# EAGLE design zigduino-v6a (EAGLE 5.10)
BOM: INCLUDE; COLOR: RED; DNP: T; PARTNO: PPPC081LFBN; VOLT: 40V
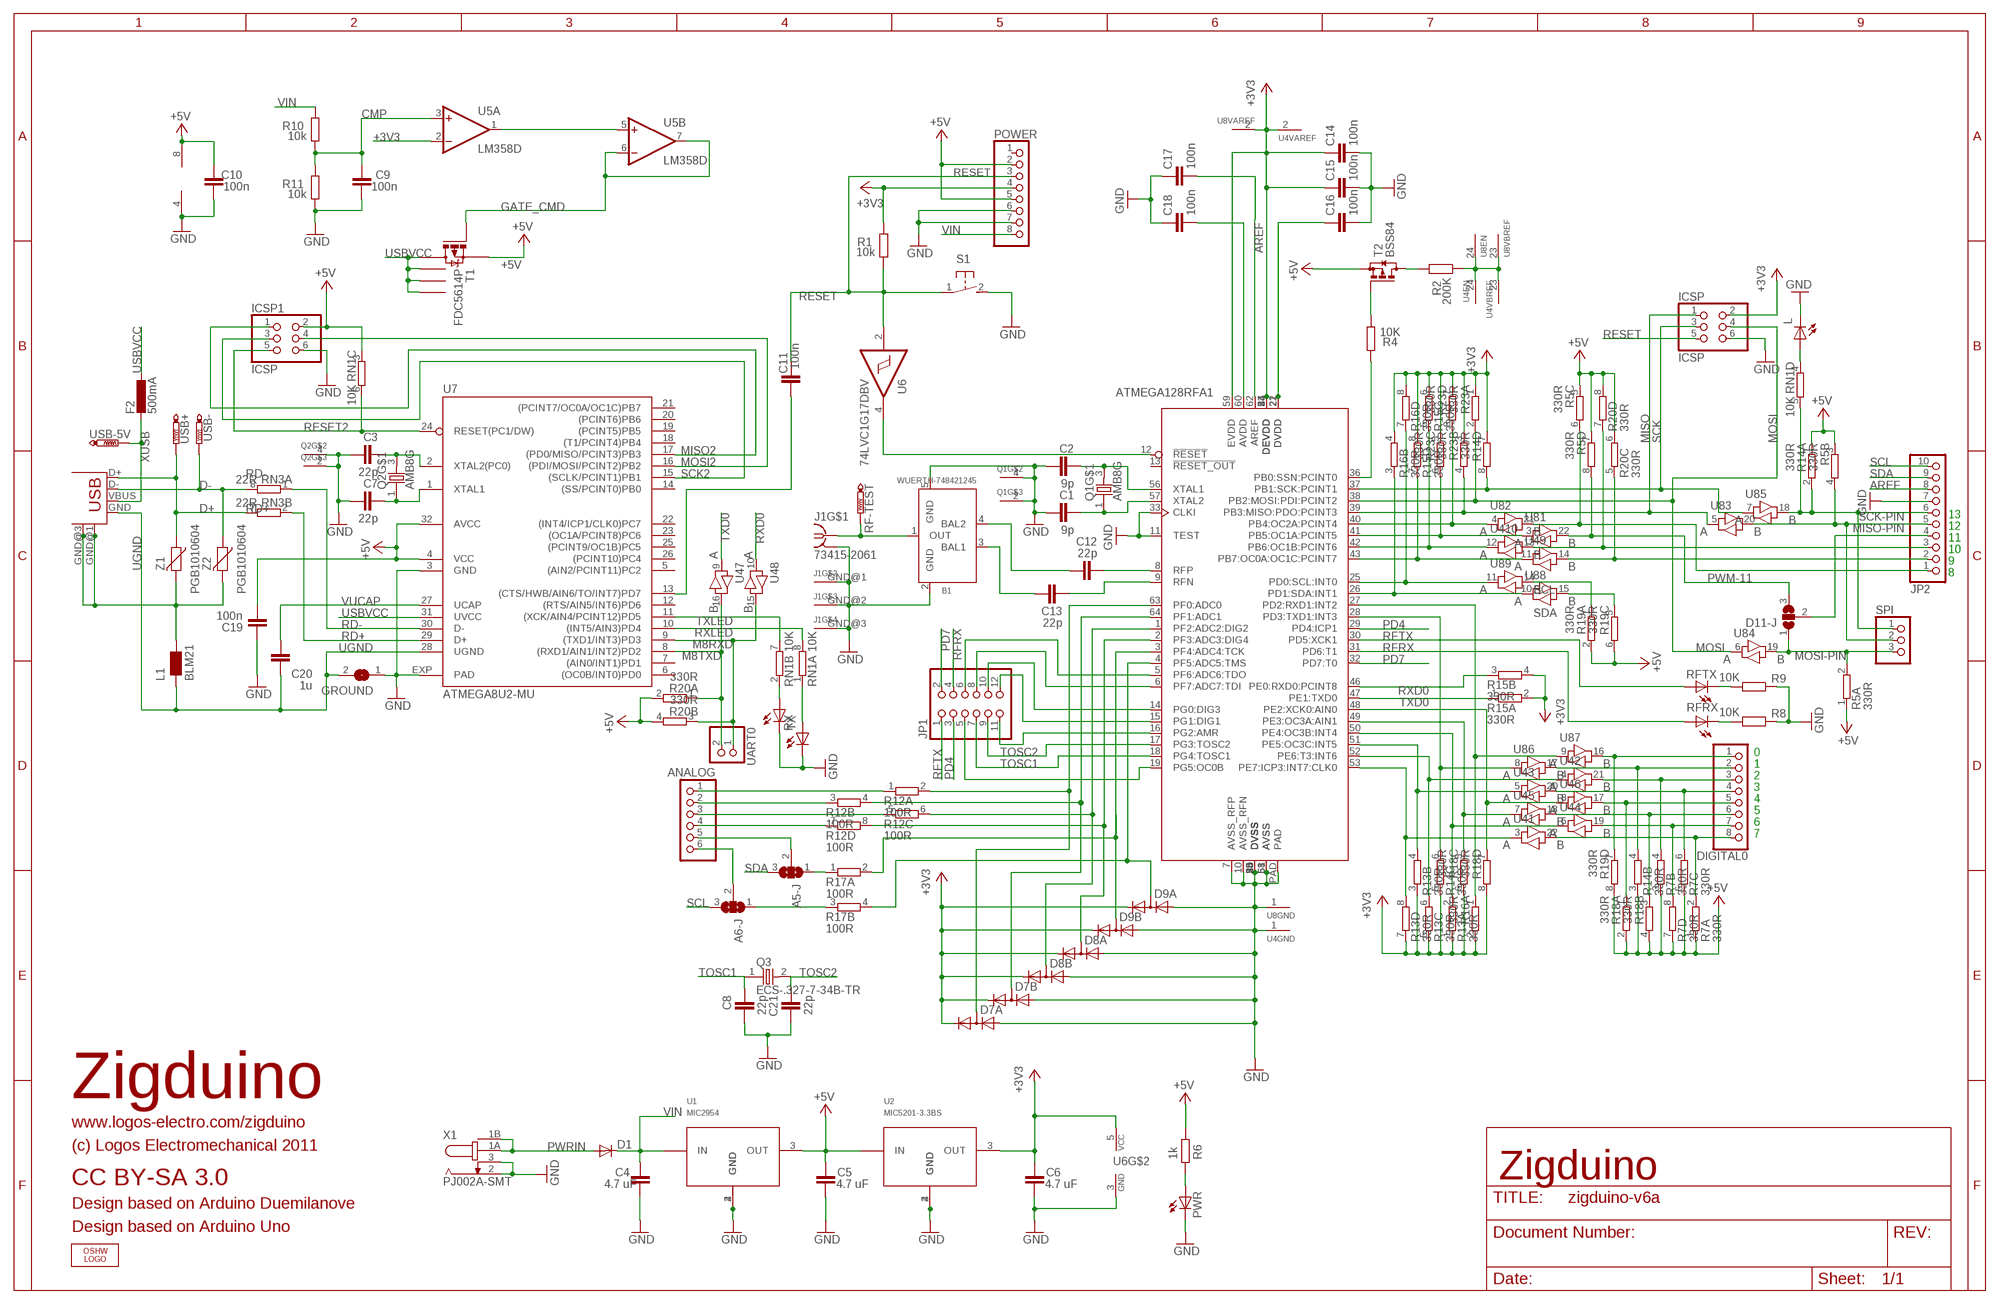
[diagram p0: schematic, sheet 1]

## Parts
A5-J  SJ2W  [SJ_2]
A6-J  SJ2W  [SJ_2]
ANALOG  PINHD-1X6  [1X06]
B1  WUERTH-748421245  [WURTH-BALUN]
C1  9p  C-EUC0603  [C0603]
C2  9p  C-EUC0603  [C0603]
C3  22p  C-EUC0603  [C0603]
C4  4.7 uF  C-EUC1206  [C1206]
C5  4.7 uF  C-EUC1206  [C1206]
C6  4.7 uF  C-EUC1206  [C1206]
C7  22p  C-EUC0603  [C0603]
C8  22p  C-EUC0603  [C0603]
C9  100n  C-EUC0603  [C0603]
C10  100n  C-EUC0603  [C0603]
C11  100n  C-EUC0603  [C0603]
C12  22p  C-EUC0603  [C0603]
C13  22p  C-EUC0603  [C0603]
C14  100n  C-EUC0603  [C0603]
C15  100n  C-EUC0603  [C0603]
C16  100n  C-EUC0603  [C0603]
C17  100n  C-EUC0603  [C0603]
C18  100n  C-EUC0603  [C0603]
C19  100n  C-EU0603-RND  [C0603-ROUND]
C20  1u  C-EU0603-RND  [C0603-ROUND]
C21  22p  C-EUC0603  [C0603]
D1  DIODE-SMB  [SMB]
D7  SD103ASDM  [SOT26]
D8  SD103ASDM  [SOT26]
D9  SD103ASDM  [SOT26]
D11-J  SJ2W  [SJ_2]
DIGITAL0  PINHD-1X8  [1X08]
F2  500mA  L-EUL1812  [L1812]
GROUND  SJ  [SJ]
ICSP  ICSP  PINHD-2X3  [2X03]
ICSP1  ICSP  PINHD-2X3  [2X03]
J1  73415-2061  [MMCX]
JP1  PINHD-2X6_2.00  [2X06M]
JP2  PINHD-1X10  [1X10]
L  LEDCHIP-LED0603  [CHIP-LED0603]
L1  BLM21  WE-CBF_0805  [0805]
LOGO1  OSHW_LOGO_FILLX0200-NT  [OSHW_FILLX200_NOTEXT]
POWER  PINHD-1X8  [1X08]
PWR  LEDCHIP-LED0603  [CHIP-LED0603]
Q1  AMB8G  [ABM8G]
Q2  AMB8G  [ABM8G]
Q3  ECS-.327-7-34B-TR  [ECX-31B]
R1  10k  R-EU_R0603  [R0603]
R2  200K  R-EU_R0603  [R0603]
R4  10K  R-EU_R0603  [R0603]
R5  330R  4R-NCTS742C083  [CTS742C083-RES]
R6  1k  R-EU_R0603  [R0603]
R7  330R  4R-NCTS742C083  [CTS742C083-RES]
R8  10K  R-EU_R0603  [R0603]
R9  10K  R-EU_R0603  [R0603]
R10  10k  R-EU_R0603  [R0603]
R11  10k  R-EU_R0603  [R0603]
R12  100R  4R-NCTS742C083  [CTS742C083-RES]
R13  330R  4R-NCTS742C083  [CTS742C083-RES]
R14  330R  4R-NCTS742C083  [CTS742C083-RES]
R15  330R  4R-NCTS742C083  [CTS742C083-RES]
R16  330R  4R-NCTS742C083  [CTS742C083-RES]
R17  100R  4R-NCTS742C083  [CTS742C083-RES]
R18  330R  4R-NCTS742C083  [CTS742C083-RES]
R19  330R  4R-NCTS742C083  [CTS742C083-RES]
R20  330R  4R-NCTS742C083  [CTS742C083-RES]
R23  330R  4R-NCTS742C083  [CTS742C083-RES]
RF-TEST  PTR1TP13SQ  [TP13SQ]
RFRX  LEDCHIP-LED0603  [CHIP-LED0603]
RFTX  LEDCHIP-LED0603  [CHIP-LED0603]
RN1  10K  4R-NCAY16  [CAY16]
RN3  22R  4R-NCAY16  [CAY16]
RX  LEDCHIP-LED0603  [CHIP-LED0603]
S1  B3U-1000  [B3U]
SPI  PINHD-1X3  [1X03]
T1  FDC5614P  [SSOT6]
T2  BSS84  [SOT23]
TX  LEDCHIP-LED0603  [CHIP-LED0603]
U1  MIC2954  [SOT223]
U2  MIC5201-3.3BS  [SOT223]
U3  ATMEGA128RFA1  [QFN64]
U4  NVT2010PW  [TSSOP24]
U5  LM358D  [SO08]
U6  74LVC1G17DBV  [SOT23-5]
U7  ATMEGA8U2-MU  [QFN32]
U8  NVT2010PW  [TSSOP24]
UART0  PINHD-1X2  [1X02]
USB  USB-MB-S  [USB-MB-S]
USB+  PTR1TP13SQ  [TP13SQ]
USB-  PTR1TP13SQ  [TP13SQ]
USB-5V  PTR1TP13SQ  [TP13SQ]
X1  PJ002A-SMT  [PJ002A-SMT]
Z1  PGB1010604  VARISTORCN0603  [CT/CN0603]
Z2  PGB1010604  VARISTORCN0603  [CT/CN0603]

## Nets
+3V3: C6.1 C14.1 C15.1 D7.2(A:C) D7.5(B:C) D8.2(A:C) D8.5(B:C) D9.2(A:C) D9.5(B:C) ICSP.2 POWER.4 R1.2 R13.1 R13.3 R13.5 R13.7 R14.5 R14.7 R15.2 R15.4 R15.6 R15.8 R16.2 R16.4 R16.8 R18.6 R18.8 R23.1 R23.3 R23.5 R23.7 U2.3(OUT) U3.23(DEVDD) U3.34(DEVDD) U3.44(DEVDD) U3.54(DEVDD) U3.59(EVDD) U4.2(VAREF:PIN) U5.2(A:-IN) U6.5(VCC) U8.2(VAREF:PIN)
+5V [usbvcc]: C5.1 C10.2 C19.1 ICSP1.2 POWER.2 POWER.5 R5.1 R5.3 R5.5 R5.7 R6.1 R7.1 R7.3 R7.5 R7.7 R14.1 R14.3 R18.2 R18.4 R19.2 R19.6 R19.8 R20.2 R20.4 R20.6 R20.8 RN1.3 T1.4(S) T2.2(S) U1.3(OUT) U2.1(IN) U5.8(P:V+) U7.4(VCC) U7.32(AVCC)
AREF [aref]: C17.2 JP2.8 U3.62(AREF)
CMP: C9.2 R10.1 R11.2 U5.3(A:+IN)
D+: RN3.7 USB+.TP USB.D+ Z1.1
D-: RN3.8 USB-.TP USB.D- Z2.1
DTR: C11.1 U7.13((CTS/HWB/AIN6/TO/INT7)PD7)
GATE_CMD: T1.3(G) U5.6(B:-IN) U5.7(B:OUT)
GND [gnd]: B1.2(GND) B1.5(GND) C1.1 C2.1 C3.1 C4.2 C5.2 C6.2 C7.1 C8.1 C9.1 C10.1 C14.2 C15.2 C16.2 C17.1 C18.1 C19.2 C21.1 D7.3(A:A) D7.6(B:A) D8.3(A:A) D8.6(B:A) D9.3(A:A) D9.6(B:A) GROUND.1 ICSP1.6 ICSP.6 J1.GND@0(GND) J1.GND@1(PIN) J1.GND@2(PIN) J1.GND@3(PIN) JP2.7 L.C POWER.6 POWER.7 PWR.C Q1.2(PIN) Q1.4(PIN) Q2.2(PIN) Q2.4(PIN) R8.1 R9.1 R11.1 RX.C S1.2 TX.C U1.2(GND) U1.4(GND) U2.2(GND) U2.4(GND) U3.7(AVSS_RFP) U3.10(AVSS_RFN) U3.11(TEST) U3.20(DVSS) U3.24(DVSS) U3.33(CLKI) U3.35(DVSS) U3.45(DVSS) U3.55(DVSS) U3.58(AVSS) U3.61(AVSS) U3.PAD U4.1(GND:PIN) U5.4(P:V-) U6.3(GND) U7.3(GND) U7.EXP(PAD) U8.1(GND:PIN) X1.2 X1.3
M8RXD: R20.3 U4.15(8:B) U7.9((TXD1/INT3)PD3) UART0.1
M8TXD: R20.1 U4.16(7:B) U7.8((RXD1/AIN1/INT2)PD2) UART0.2
MISO: ICSP.1 R23.4 U3.39(PB3:MISO:PDO:PCINT3) U8.5(3:A)
MISO2: ICSP1.1 U7.17((PD0/MISO/PCINT3)PB3)
MISO-PIN: JP2.5 R5.4 SPI.2 U8.20(3:B)
MOSI: ICSP.4 R23.2 U3.38(PB2:MOSI:PDI:PCINT2) U8.6(4:A)
MOSI2: ICSP1.4 U7.16((PDI/MOSI/PCINT2)PB2)
MOSI-PIN: D11-J.1 R5.2 SPI.3 U8.19(4:B)
N$1: R9.2 RFTX.C
N$2: L.A RN1.4
N$3: PWR.A R6.2
N$4 [rf]: B1.4(BAL2) C12.1
N$5: DIGITAL0.3 R7.4 U4.21(2:B)
N$6: C1.2 Q1.1 U3.57(XTAL2)
N$7: C2.2 Q1.3 U3.56(XTAL1)
N$9 [rf]: B1.3(BAL1) C13.1
N$11: DIGITAL0.5 R18.1 U4.17(6:B)
N$12: DIGITAL0.7 R7.8 U4.19(4:B)
N$13: DIGITAL0.6 R18.3 U4.18(5:B)
N$14: DIGITAL0.4 R7.6 U4.20(3:B)
N$15: DIGITAL0.8 R7.2 U4.22(1:B)
N$16: R16.7 U3.25(PD0:SCL:INT0) U8.11(9:A)
N$17: R16.3 U3.26(PD1:SDA:INT1) U8.10(8:A)
N$18 [gnd]: B1.1(OUT) J1.C RF-TEST.TP
N$19: R23.6 U3.41(PB5:OC1A:PCINT5) U8.3(1:A)
N$20: R8.2 RFRX.C
N$21: R13.6 U3.52(PE6:T3:INT6) U4.4(2:A)
N$22: R13.4 U3.51(PE5:OC3C:INT5) U4.5(3:A)
N$23 [rf]: C12.2 U3.8(RFP)
N$24 [rf]: C13.2 U3.9(RFN)
N$28: U5.1(A:OUT) U5.5(B:+IN)
N$29: U3.12(!RESET!) U6.4(O)
N$31: RN1.2 TX.A
N$32: RN1.1 RX.A
N$33: R23.8 U3.40(PB4:OC2A:PCINT4) U8.4(2:A)
N$34: C3.2 Q2.3 U7.2(XTAL2(PC0))
N$35: C7.2 Q2.1 U7.1(XTAL1)
N$37: R4.1 T2.1(G)
N$38: R15.5 U3.42(PB6:OC1B:PCINT6) U4.12(10:A)
N$39: R15.7 U3.43(PB7:OC0A:OC1C:PCINT7) U4.11(9:A)
N$40: R18.7 U3.48(PE2:XCK0:AIN0) U4.8(6:A)
N$41: R13.2 U3.50(PE4:OC3B:INT4) U4.6(4:A)
N$42: R18.5 U3.49(PE3:OC3A:AIN1) U4.7(5:A)
N$43: R13.8 U3.53(PE7:ICP3:INT7:CLK0) U4.3(1:A)
N$44: A5-J.1 R17.1
N$45: A6-J.1 R17.3
N$46: JP1.6 U3.5(PF6:ADC6:TDO)
N$47: JP1.8 U3.6(PF7:ADC7:TDI)
N$48: D7.4(A:AC) R12.2 U3.63(PF0:ADC0)
N$49: D7.1(B:AC) R12.4 U3.64(PF1:ADC1)
N$50: D8.1(B:AC) R12.6 U3.1(PF2:ADC2:DIG2)
N$51: D8.4(A:AC) R12.8 U3.2(PF3:ADC3:DIG4)
N$52: D9.1(B:AC) R17.2 U3.3(PF4:ADC4:TCK)
N$53: D9.4(A:AC) R17.4 U3.4(PF5:ADC5:TMS)
N$54: ANALOG.1 R12.1
N$55: ANALOG.2 R12.3
N$56: ANALOG.3 R12.5
N$57: ANALOG.4 R12.7
N$58: A5-J.2 ANALOG.5
N$59: A6-J.2 ANALOG.6
N$60: JP2.1 R5.6 U8.21(2:B)
N$61: D11-J.2 JP2.4
N$62: JP1.10 U3.14(PG0:DIG3)
N$63: C16.1 U3.21(DVDD) U3.22(DVDD)
N$64: C18.2 U3.60(AVDD)
N$65: JP2.2 R20.5 U4.14(9:B)
N$66: R4.2 U3.36(PB0:SSN:PCINT0)
N$67: R2.2 T2.3(D)
N$68: DIGITAL0.1 R19.7 U8.16(7:B)
N$69: DIGITAL0.2 R14.4 U8.17(6:B)
N$70: JP1.12 U3.15(PG1:DIG1)
N$71: JP1.5 U3.19(PG5:OC0B)
N$74: JP1.11 U3.16(PG2:AMR)
N$78: R2.1 U4.23(VBREF:PIN) U4.24(EN:PIN) U8.23(VBREF:PIN) U8.24(EN:PIN)
PD4: JP1.3 U3.29(PD4:ICP1)
PD7: JP1.2 U3.32(PD7:T0)
PWM-10: JP2.3 R20.7 U4.13(10:B)
PWM-11: D11-J.3 R5.8 U8.22(1:B)
PWRIN [power]: D1.A X1.1A X1.1B
RD+: RN3.2 U7.29(D+)
RD-: RN3.1 U7.30(D-)
RESET: C11.2 ICSP.5 POWER.3 R1.1 S1.1 U6.2(I)
RESET2: ICSP1.5 RN1.6 U7.24(RESET(PC1/DW))
RFRX: JP1.4 RFRX.A U3.31(PD6:T1)
RFTX: JP1.1 RFTX.A U3.30(PD5:XCK1)
RXD0: R15.3 U3.46(PE0:RXD0:PCINT8) U4.10(8:A)
RXD1: R16.1 U3.27(PD2:RXD1:INT2) U8.9(7:A)
RXLED: RN1.8 U7.10((INT5/AIN3)PD4)
SCK: ICSP.3 R14.8 U3.37(PB1:SCK:PCINT1) U8.7(5:A)
SCK2: ICSP1.3 U7.15((SCLK/PCINT1)PB1)
SCK-PIN: JP2.6 R14.2 RN1.5 SPI.1 U8.18(5:B)
SCL: A6-J.3 JP2.10 R19.1 U8.14(9:B)
SDA: A5-J.3 JP2.9 R19.5 U8.15(8:B)
TOSC1: C8.2 JP1.7 Q3.1 U3.18(PG4:TOSC1)
TOSC2: C21.2 JP1.9 Q3.2 U3.17(PG3:TOSC2)
TXD0: R15.1 U3.47(PE1:TXD0) U4.9(7:A)
TXD1: R14.6 U3.28(PD3:TXD1:INT3) U8.8(6:A)
TXLED: RN1.7 U7.11((XCK/AIN4/PCINT12)PD5)
UGND: C20.2 GROUND.2 L1.1 U7.28(UGND) USB.GND
USBVCC [usbvcc]: F2.1 T1.1(D) T1.2(D) T1.5(D) T1.6(D) U7.31(UVCC)
USHIELD: L1.2 USB.GND@1(GND) USB.GND@3(GND) Z1.2 Z2.2
VIN [power]: C4.1 D1.C POWER.8 R10.2 U1.1(IN)
VUCAP: C20.1 U7.27(UCAP)
XUSB: F2.2 USB-5V.TP USB.VBUS
Unconnected: POWER.1 R16.5 R16.6 R17.5 R17.6 R17.7 R17.8 R19.3 R19.4 RN3.3 RN3.4 RN3.5 RN3.6 U3.13(!RESET_OUT!) U7.5((AIN2/PCINT11)PC2) U7.6((OC0B/INT0)PD0) U7.7((AIN0/INT1)PD1) U7.12((RTS/AIN5/INT6)PD6) U7.14((SS/PCINT0)PB0) U7.18((T1/PCINT4)PB4) U7.19((PCINT5)PB5) U7.20((PCINT6)PB6) U7.21((PCINT7/OC0A/OC1C)PB7) U7.22((INT4/ICP1/CLK0)PC7) U7.23((OC1A/PCINT8)PC6) U7.25((PCINT9/OC1B)PC5) U7.26((PCINT10)PC4) U8.12(10:A) U8.13(10:B)

## Notes on the sheet
- ATMEGA128RFA1
- 13
- 12
- 11
- 10
- 9
- 8
- 0
- 1
- 2
- 3
- 4
- 5
- 6
- 7
- Zigduino
- www.logos-electro.com/zigduino
- (c) Logos Electromechanical 2011
- CC BY-SA 3.0 | Zigduino
- Design based on Arduino Duemilanove
- Design based on Arduino Uno

## Library data of the parts
A5-J A6-J D11-J = jumper:SJ2W: SMD solder JUMPER
ANALOG = pinhead:PINHD-1X6: PIN HEADER
B1 = atmega128rfa1:WUERTH-748421245: Recommended Balun for Atmega128RFA1
C1-C18 C21 = resistor:C-EU: CAPACITOR, European symbol
C19 C20 = SmartPrj:C-EU: CAPACITOR, European symbol
D1 = diode:DIODE-: DIODE
D7-D9 = logos-diodes:SD103ASDM: Digikey SD103ASDM-FDICT-ND
DIGITAL0 POWER = pinhead:PINHD-1X8: PIN HEADER
F2 = rcl:L-EU: INDUCTOR, European symbol
GROUND = jumper:SJ: SMD solder JUMPER
ICSP ICSP1 = pinhead:PINHD-2X3: PIN HEADER
J1 = atmega128rfa1:73415-2061: Molex 73415-2061
JP1 = pinhead-1:PINHD-2X6: PIN HEADER
JP2 = pinhead:PINHD-1X10: PIN HEADER
L PWR RFRX RFTX RX TX = led:LED: LED OSRAM: - CHIPLED LG R971, LG N971, LY N971, LG Q971, LY Q971, LO R971, LY R971 LH N974, LH R974 LS Q976, LO Q976, LY Q976 LO Q996 - Hyper CHIPLED LW Q18S LB Q993, LB Q99A, LB R99A - SideLED LS A670, LO A670, LY A670, LG A670, LP A670 LB A673, LV A673, LT A673, LW A673 LH A674 LY A675 LS A676, LA A676, LO A676, LY A676, LW A676 LS A679, LY A679, LG A679 - Hyper Micro SIDELED® LS Y876, LA Y876, LO Y876, LY Y876 LT Y87S - SmartLED LW L88C, LW L88S LB L89C, LB L89S, LG L890 LS L89K, LO L89K, LY L89K LS L896, LA L896, LO L896, LY L896 - TOPLED LS T670, LO T670, LY T670, LG T670, LP T670 LSG T670, LSP T670, LSY T670, LOP T670, LYG T670 LG T671, LOG T671, LSG T671 LB T673, LV T673, LT T673, LW T673 LH T674 LS T676, LA T676, LO T676, LY T676, LB T676, LH T676, LSB T676, LW T676 LB T67C, LV T67C, LT T67C, LS T67K, LO T67K, LY T67K, LW E67C LS E67B, LA E67B, LO E67B, LY E67B, LB E67C, LV E67C, LT E67C LW T67C LS T679, LY T679, LG T679 LS T770, LO T770, LY T770, LG T770, LP T770 LB T773, LV T773, LT T773, LW T773 LH T774 LS E675, LA E675, LY E675, LS T675 LS T776, LA T776, LO T776, LY T776, LB T776 LHGB T686 LT T68C, LB T68C - Hyper Mini TOPLED® LB M676 - Mini TOPLED Santana® LG M470 LS M47K, LO M47K, LY M47K Source: http://www.osram.convergy.de LUXEON: - LUMILED® LXK2-PW12-R00, LXK2-PW12-S00, LXK2-PW14-U00, LXK2-PW14-V00 LXK2-PM12-R00, LXK2-PM12-S00, LXK2-PM14-U00 LXK2-PE12-Q00, LXK2-PE12-R00, LXK2-PE12-S00, LXK2-PE14-T00, LXK2-PE14-U00 LXK2-PB12-K00, LXK2-PB12-L00, LXK2-PB12-M00, LXK2-PB14-N00, LXK2-PB14-P00, LXK2-PB14-Q00 LXK2-PR12-L00, LXK2-PR12-M00, LXK2-PR14-Q00, LXK2-PR14-R00 LXK2-PD12-Q00, LXK2-PD12-R00, LXK2-PD12-S00 LXK2-PH12-R00, LXK2-PH12-S00 LXK2-PL12-P00, LXK2-PL12-Q00, LXK2-PL12-R00 Source: www.luxeon.com KINGBRIGHT: KA-3528ASYC Source: www.kingbright.com
L1 = wuerth-elektronik:WE-CBF: SMD EMI Suppression Ferrite Beads - excellent anti-EMI properties - low DCR - impedances till 3000 ohms - rated current up to 6 A
LOGO1 = OSHW:OSHW_LOGO_FILL
Q1 Q2 = atmega128rfa1:AMB8G: AMB8G series ultraminature crystal
Q3 = logos-rtc:ECS-.327-7-34B-TR: CRYSTAL 32.768 KHZ 7PF SMD
R1 R2 R4 R6 R8-R11 = resistor:R-EU_: RESISTOR, European symbol
R5 R7 R12-R20 R23 = res-cap-arrays:4R-N: Array Chip Resistor Source: RS Component / Phycomp
RF-TEST USB+ USB- USB-5V = testpad:PTR1: TEST PIN
RN1 RN3 = resistor-dil:4R-N: Array Chip Resistor Source: RS Component / Phycomp
S1 = logos-faves:B3U-1000: Omron B3U-1000 SMD tact switch
SPI = pinhead:PINHD-1X3: PIN HEADER
T1 = logos-power:FDC5614P
T2 = transistor-small-signal:BSS84: P-CHANNEL MOS FET
U1 = logos-faves:MIC2954: 5V 250mA regulator
U2 = logos-faves:MIC5201: 200 mA 3.3V LDO linear regulator
U3 = atmega128rfa1:ATMEGA128RFA1: Atmega128RFA1 -- Atmega128 with Zigbee
U4 U8 = atmega128rfa1:NVT2010: NVT2010 10 bit bidirectional level shifter
U5 = linear:LM358: OP AMP also LM158; LM258; LM2904 Source: http://cache.national.com/ds/LM/LM158.pdf
U6 = 74xx-little-us:74*1G17: Single Schmitt-Trigger Buffer
U7 = atmel:ATMEGA8U2-MU
UART0 = pinhead:PINHD-1X2: PIN HEADER
USB = con-usb-2:USB: USB Connectors
X1 = logos-headers:PJ002A
Z1 Z2 = varistor:VARISTOR: VARISTOR

## Net classes
0 default: width 0.152 mm, drill 0.305 mm, clearance 0.152 mm
1 power: width 0.305 mm, drill 0.381 mm
2 gnd: width 0.305 mm, drill 0.381 mm
3 usbvcc: width 0.305 mm, drill 0.381 mm
4 aref: width 0.305 mm
5 rf: width 0.305 mm

## Board
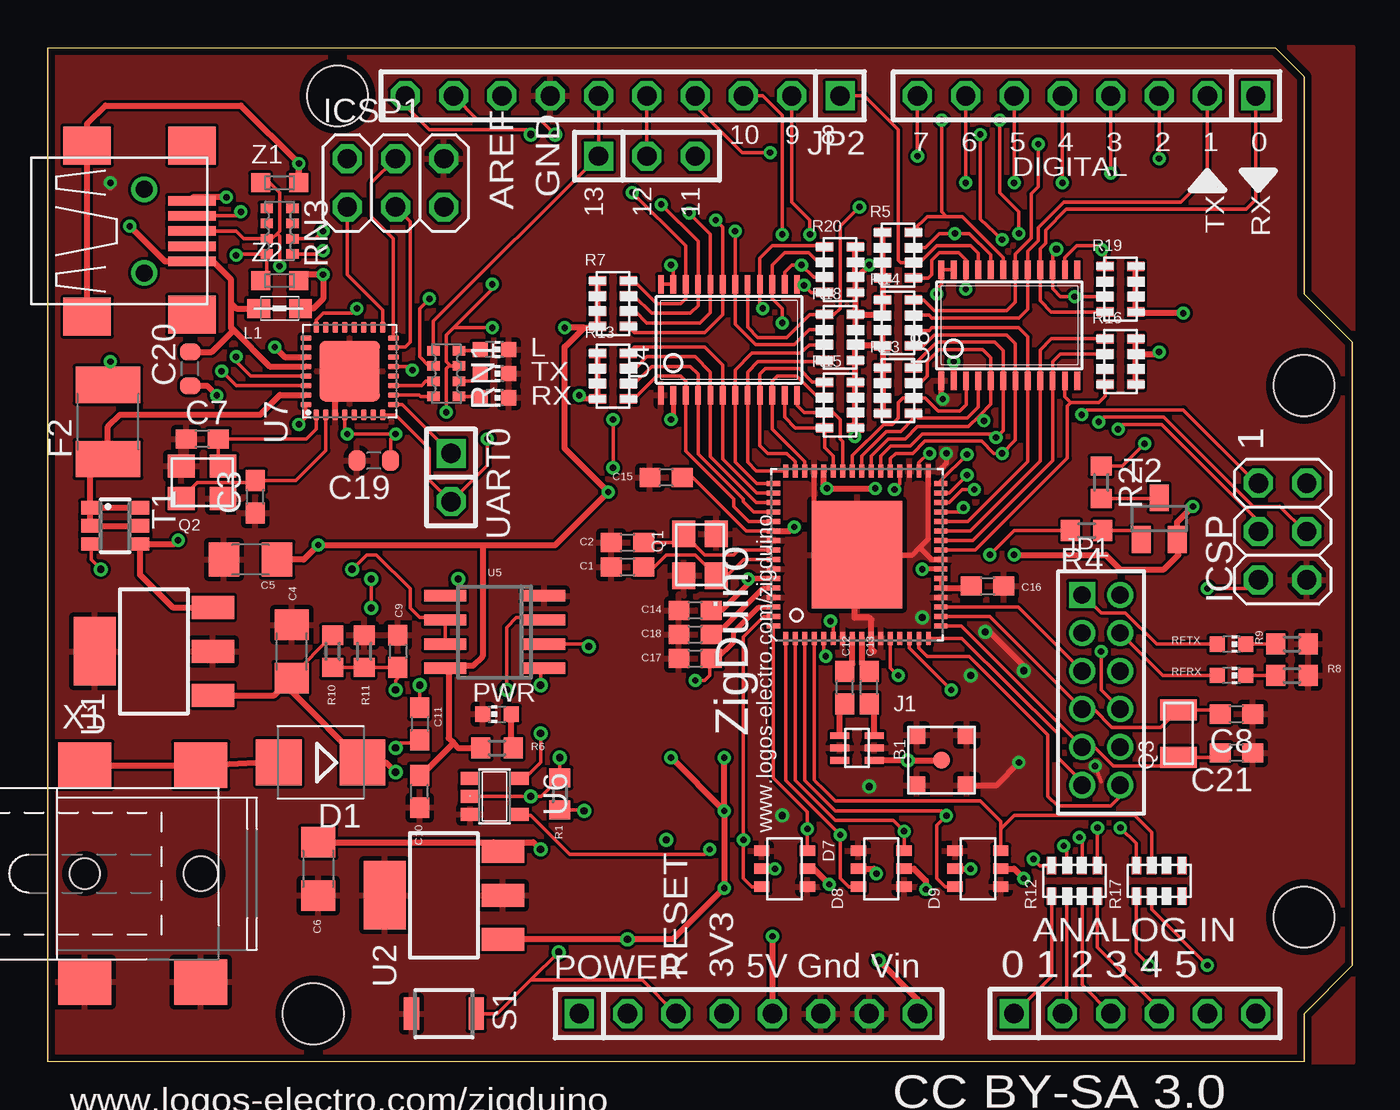
[diagram p1: board, top side]
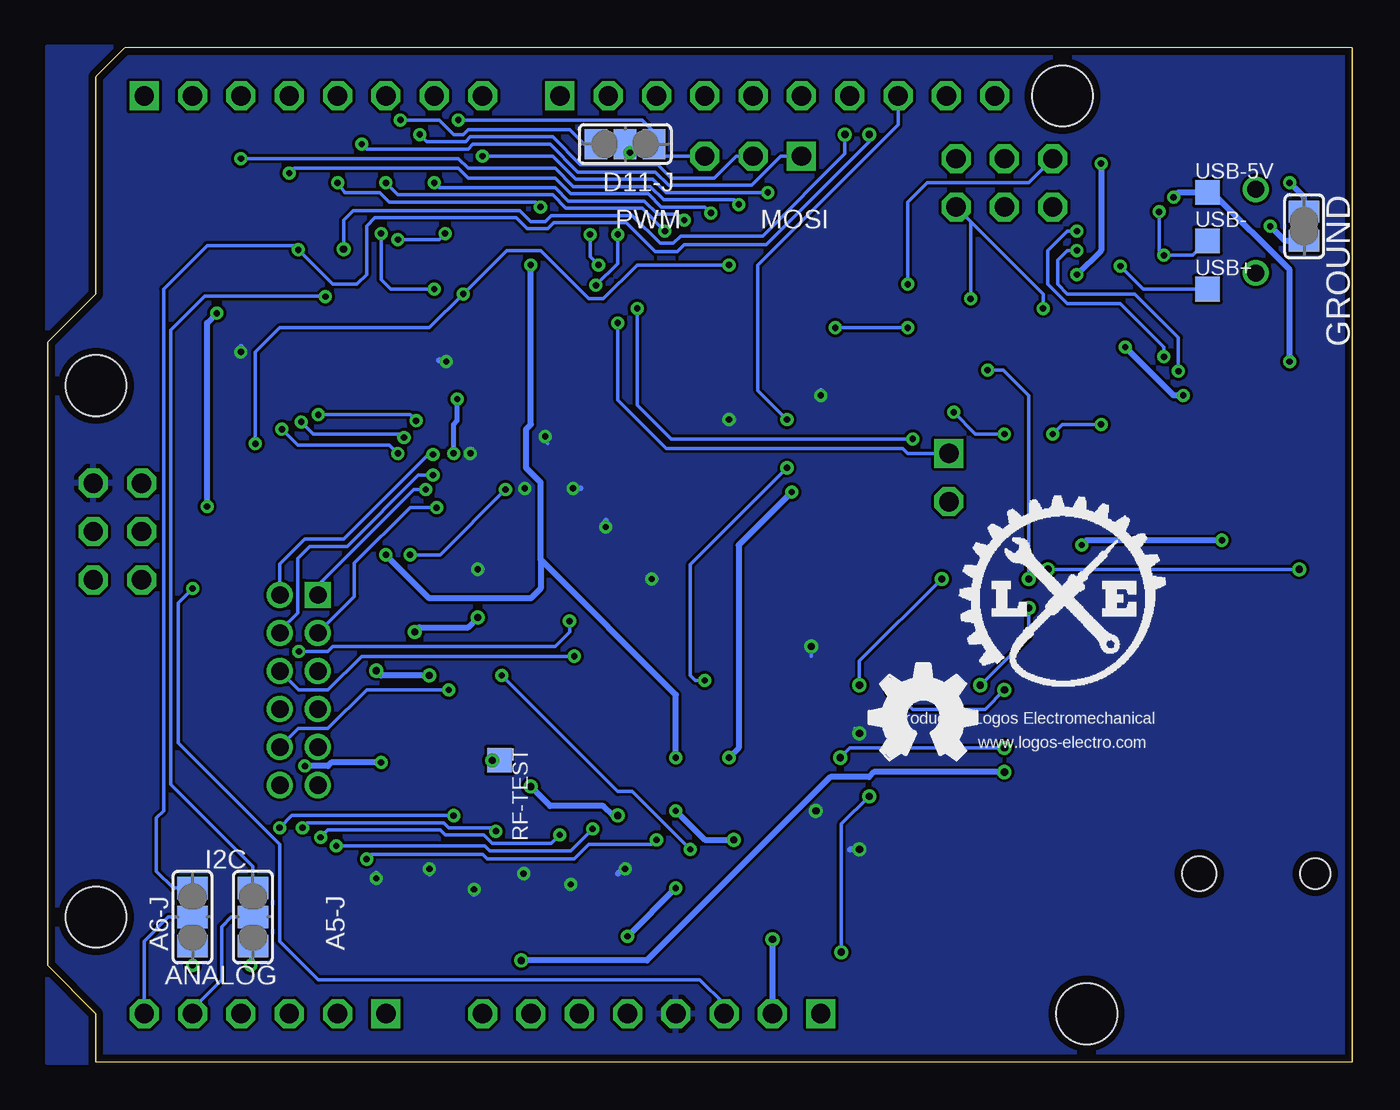
[diagram p2: board, bottom side, seen from below]

Size 68.58 x 53.34 mm. Coordinates in mm from the lower left corner, seen from the top.
Outline: 0,53.34 64.52,53.34 66.04,51.82 66.04,40.39 68.58,37.85 68.58,5.08 66.04,2.54 66.04,0 0,0 0,53.34
Copper layers (1*16): Top 0.0356mm / dielectric 1.5011mm / Bottom 0.0356mm
Design rules "LaenPCBOrder": minimum track width 6mil, minimum drill 13mil, track to track 6mil, track to pad 6mil, pad to pad 6mil, via to via 6mil, smd to smd 6mil, copper to edge 15mil, drill to drill 6mil, minimum pad ring 7mil, minimum via ring 7mil, stop-mask expansion 4mil, vias tented up to drill 0mil, thermal gap 10mil
Holes 3.2 mm at 66.04,35.56 66.04,7.62 15.24,50.8 13.97,2.54
Milling: 7 lines

### Footprints (pad centres in the part's own frame; a part is rotated, then mirrored left to right if it is on the bottom)
SJ_2 = smd 1.168 x 1.6: 1 -1.524,0; 2 0,0; 3 1.524,0
1X06 = drill 1.016 square: 1 -6.35,0 | drill 1.016 octagon: 2 -3.81,0; 3 -1.27,0; 4 1.27,0; 5 3.81,0; 6 6.35,0
WURTH-BALUN = smd 0.35 x 1: 1 0.65,0.9; 2 0,0.9; 3 -0.65,0.9; 4 -0.65,-0.9; 5 0,-0.9; 6 0.65,-0.9
C0603 = smd 1.1 x 1: 1 -0.85,0; 2 0.85,0
C1206 = smd 1.6 x 1.8: 1 -1.4,0; 2 1.4,0
C0603-ROUND = smd 0.898 x 1.1: 1 -0.889,0; 2 0.889,0
SMB = smd 2.4 x 2.4: A 2.2,0; C -2.2,0
SOT26 = smd 0.55 x 0.8: 1 -0.95,1.2; 2 0,1.2; 3 0.95,1.2; 4 0.95,-1.2; 5 0,-1.2; 6 -0.95,-1.2
1X08 = drill 1.016 square: 1 -8.89,0 | drill 1.016 octagon: 2 -6.35,0; 3 -3.81,0; 4 -1.27,0; 5 1.27,0; 6 3.81,0; 7 6.35,0; 8 8.89,0
L1812 = smd 1.9 x 3.4: 1 -1.95,0; 2 1.95,0
SJ = smd 1.168 x 1.6: 1 -0.762,0; 2 0.762,0
2X03 = drill 1.016 octagon: 1 -2.54,-1.27; 2 -2.54,1.27; 3 0,-1.27; 4 0,1.27; 5 2.54,-1.27; 6 2.54,1.27
MMCX = smd 0.89 x 0.89: C 0,0 | smd 0.94 x 0.94: GND@0 -1.32,1.32; GND@1 1.32,1.32; GND@2 -1.32,-1.32; GND@3 1.32,-1.32
2X06M = drill 0.914 square: 1 -5,-1 | drill 0.914 round: 2 -5,1; 3 -3,-1; 4 -3,1; 5 -1,-1; 6 -1,1; 7 1,-1; 8 1,1; 9 3,-1; 10 3,1; 11 5,-1; 12 5,1
1X10 = drill 1.016 square: 1 -11.43,0 | drill 1.016 octagon: 2 -8.89,0; 3 -6.35,0; 4 -3.81,0; 5 -1.27,0; 6 1.27,0; 7 3.81,0; 8 6.35,0; 9 8.89,0; 10 11.43,0
CHIP-LED0603 = smd 0.8 x 0.8: A 0,-0.75; C 0,0.75
0805 = smd 1.2 x 1: 1 -1.1,0; 2 1.1,0
ABM8G = smd 1.4 x 1.2: 1 -1.1,-0.85; 2 1.1,-0.85; 3 1.1,0.85; 4 -1.1,0.85
ECX-31B = smd 1.1 x 1.9: 1 -1.25,0; 2 1.25,0
R0603 = smd 1 x 1.1: 1 -0.85,0; 2 0.85,0
CTS742C083-RES = smd 0.9 x 0.5: 1 -0.8,1.2; 2 0.8,1.2; 3 -0.8,0.4; 4 0.8,0.4; 5 -0.8,-0.4; 6 0.8,-0.4; 7 -0.8,-1.2; 8 0.8,-1.2
TP13SQ = smd 1.3 x 1.3: TP 0,0
CAY16 = smd 0.5 x 0.65: 1 -1.2,-0.675; 2 -0.4,-0.675; 3 0.4,-0.675; 4 1.2,-0.675; 5 1.2,0.675; 6 0.4,0.675; 7 -0.4,0.675; 8 -1.2,0.675
B3U = smd 0.8 x 1.7: 1 -1.7,0; 2 1.7,0
1X03 = drill 1.016 square: 1 -2.54,0 | drill 1.016 octagon: 2 0,0; 3 2.54,0
SSOT6 = smd 0.69 x 0.99: 1 -0.95,-1.3; 2 0,-1.3; 3 0.95,-1.3; 4 0.95,1.3; 5 0,1.3; 6 -0.95,1.3
SOT23 = smd 1 x 1.4: 1 -0.95,-1.1; 2 0.95,-1.1; 3 0,1.1
SOT223 = smd 1.219 x 2.235: 1 -2.311,-3.099; 2 0,-3.099; 3 2.311,-3.099 | smd 3.6 x 2.2: 4 0,3.099
QFN64 = smd 0.7 x 0.25: 1 -4.4,3.75; 2 -4.4,3.25; 3 -4.4,2.75; 4 -4.4,2.25; 5 -4.4,1.75; 6 -4.4,1.25; 7 -4.4,0.75; 8 -4.4,0.25; 9 -4.4,-0.25; 10 -4.4,-0.75; 11 -4.4,-1.25; 12 -4.4,-1.75; 13 -4.4,-2.25; 14 -4.4,-2.75; 15 -4.4,-3.25; 16 -4.4,-3.75; 33 4.4,-3.75; 34 4.4,-3.25; 35 4.4,-2.75; 36 4.4,-2.25; 37 4.4,-1.75; 38 4.4,-1.25; 39 4.4,-0.75; 40 4.4,-0.25; 41 4.4,0.25; 42 4.4,0.75; 43 4.4,1.25; 44 4.4,1.75; 45 4.4,2.25; 46 4.4,2.75; 47 4.4,3.25; 48 4.4,3.75 | smd 0.25 x 0.7: 17 -3.75,-4.4; 18 -3.25,-4.4; 19 -2.75,-4.4; 20 -2.25,-4.4; 21 -1.75,-4.4; 22 -1.25,-4.4; 23 -0.75,-4.4; 24 -0.25,-4.4; 25 0.25,-4.4; 26 0.75,-4.4; 27 1.25,-4.4; 28 1.75,-4.4; 29 2.25,-4.4; 30 2.75,-4.4; 31 3.25,-4.4; 32 3.75,-4.4; 49 3.75,4.4; 50 3.25,4.4; 51 2.75,4.4; 52 2.25,4.4; 53 1.75,4.4; 54 1.25,4.4; 55 0.75,4.4; 56 0.25,4.4; 57 -0.25,4.4; 58 -0.75,4.4; 59 -1.25,4.4; 60 -1.75,4.4; 61 -2.25,4.4; 62 -2.75,4.4; 63 -3.25,4.4; 64 -3.75,4.4 | smd 5.65 x 4.75: PAD 0,0
TSSOP24 = smd 0.305 x 0.991: 1 -3.575,-2.918; 2 -2.925,-2.918; 3 -2.275,-2.918; 4 -1.625,-2.918; 5 -0.975,-2.918; 6 -0.325,-2.918; 7 0.325,-2.918; 8 0.975,-2.918; 9 1.625,-2.918; 10 2.275,-2.918; 11 2.925,-2.918; 12 3.575,-2.918; 13 3.575,2.918; 14 2.925,2.918; 15 2.275,2.918; 16 1.625,2.918; 17 0.975,2.918; 18 0.325,2.918; 19 -0.325,2.918; 20 -0.975,2.918; 21 -1.625,2.918; 22 -2.275,2.918; 23 -2.925,2.918; 24 -3.575,2.918
SO08 = smd 0.6 x 2.2: 1 -1.905,-2.6; 2 -0.635,-2.6; 3 0.635,-2.6; 4 1.905,-2.6; 5 1.905,2.6; 6 0.635,2.6; 7 -0.635,2.6; 8 -1.905,2.6
SOT23-5 = smd 0.69 x 0.99: 1 -0.95,-1.29; 2 0,-1.29; 3 0.95,-1.29; 4 0.95,1.3; 5 -0.95,1.3
QFN32 = smd 0.6 x 0.3: 1 -2.3,1.75; 2 -2.3,1.25; 3 -2.3,0.75; 4 -2.3,0.25; 5 -2.3,-0.25; 6 -2.3,-0.75; 7 -2.3,-1.25; 8 -2.3,-1.75; 17 2.3,-1.75; 18 2.3,-1.25; 19 2.3,-0.75; 20 2.3,-0.25; 21 2.3,0.25; 22 2.3,0.75; 23 2.3,1.25; 24 2.3,1.75 | smd 0.3 x 0.6: 9 -1.75,-2.3; 10 -1.25,-2.3; 11 -0.75,-2.3; 12 -0.25,-2.3; 13 0.25,-2.3; 14 0.75,-2.3; 15 1.25,-2.3; 16 1.75,-2.3; 25 1.75,2.3; 26 1.25,2.3; 27 0.75,2.3; 28 0.25,2.3; 29 -0.25,2.3; 30 -0.75,2.3; 31 -1.25,2.3; 32 -1.75,2.3 | smd 3.2 x 3.2: EXP 0,0
1X02 = drill 1.016 square: 1 -1.27,0 | drill 1.016 octagon: 2 1.27,0
USB-MB-S = smd 2.5 x 0.5: D+ 2.5,0; D- 2.5,0.8; GND 2.5,-1.6; ID 2.5,-0.8; VBUS 2.5,1.6 | smd 2.5 x 2: GND@1 -3,4.5; GND@2 2.5,4.5; GND@3 -3,-4.5; GND@4 2.5,-4.4 | drill 0.9 round: P$5 0,2.2; P$6 0,-2.2
PJ002A-SMT = smd 2.8 x 2.4: 1A 5,5.7; 1B 11.1,5.7; 2 5,-5.7; 3 11.1,-5.7 | hole 1.6: 5,0 | hole 1.8: 11.1,0
CT/CN0603 = smd 1 x 1: 1 -1,0; 2 1,0

### Placement (x,y rotation side)
A5-J  57.78,7.62 90 bottom
A6-J  60.96,7.62 90 bottom
ANALOG  57.15,2.54 0 top
B1  42.55,16.51 270 top
C1  30.48,26.04 0 top
C2  30.48,27.3 0 top
C3  10.92,29.72 90 top
C4  12.83,21.59 90 top
C5  10.67,26.42 180 top
C6  14.22,10.16 270 top
C7  8.13,32.77 0 top
C8  62.48,18.29 180 top
C9  18.41,21.59 270 top
C10  19.56,14.22 90 top
C11  19.56,17.78 270 top
C12  41.91,19.68 90 top
C13  43.18,19.68 90 top
C14  34.04,23.75 180 top
C15  32.51,30.73 180 top
C16  49.4,25.02 0 top
C17  34.04,21.21 0 top
C18  34.04,22.48 0 top
C19  17.14,31.62 180 top
C20  7.49,36.45 90 top
C21  62.48,16.26 180 top
D1  14.35,15.75 180 top
D7  38.73,10.16 270 top
D8  43.81,10.16 90 top
D9  48.9,10.16 90 top
D11-J  38.23,48.26 180 bottom
DIGITAL0  54.61,50.8 180 top
F2  3.17,33.66 90 top
GROUND  2.54,43.94 270 bottom
ICSP  64.91,27.89 270 top
ICSP1  18.29,46.23 0 top
J1  46.99,15.88 0 top
JP1  55.37,19.56 270 top
JP2  30.23,50.8 180 top
L  23.5,37.47 270 top
L1  12.19,39.62 0 top
LOGO1  25.4,15.88 0 bottom
POWER  36.83,2.54 0 top
PWR  23.62,18.29 90 top
Q1  34.29,26.67 90 top
Q2  8.13,30.48 180 top
Q3  59.44,17.27 270 top
R1  26.92,14.1 270 top
R2  55.37,30.48 270 top
R4  54.61,27.94 180 top
R5  44.7,42.42 0 top
R6  23.62,16.51 0 top
R7  29.72,39.88 0 top
R8  65.41,20.32 180 top
R9  65.41,21.97 180 top
R10  14.99,21.59 90 top
R11  16.64,21.59 270 top
R12  53.98,9.53 90 top
R13  29.72,36.07 0 top
R14  44.7,38.86 0 top
R15  41.66,34.54 0 top
R16  56.39,36.83 0 top
R17  58.42,9.53 90 top
R18  41.66,38.1 0 top
R19  56.39,40.64 0 top
R20  41.66,41.66 0 top
R23  44.7,35.31 0 top
RF-TEST  44.83,15.88 270 bottom
RFRX  62.23,20.32 270 top
RFTX  62.23,21.97 270 top
RN1  20.95,36.2 90 top
RN3  12.19,43.69 90 top
RX  23.5,34.92 270 top
S1  20.83,2.54 180 top
SPI  31.5,47.62 0 top
T1  3.56,28.19 270 top
T2  58.42,28.57 0 top
TX  23.5,36.2 270 top
U1  5.59,21.59 90 top
U2  20.83,8.76 90 top
U3  42.55,26.67 90 top
U4  35.81,37.97 0 top
U5  23.5,22.61 90 top
U6  23.5,13.97 270 top
U7  15.88,36.32 90 top
U8  50.55,38.73 0 top
U$4  [LOGO-SM]  21.08,19.43 0 bottom
UART0  21.21,30.73 270 top
USB  5.08,43.69 0 top
USB+  7.62,40.64 0 bottom
USB-  7.62,43.18 0 bottom
USB-5V  7.62,45.72 0 bottom
X1  -3.05,9.91 0 top
Z1  12.19,46.23 0 top
Z2  12.19,41.08 0 top

### Tracks (layer width: path | path; a pad name or v marks a point on that pad's centre or on a via)
+3V3  (via drill 0.33, 0.38)
  Top 0.178: U3.54 36.72,27.92 33.91,30.73 C15.1 | R15.8 42.46,32.87 v42.42,32.89 | U3.34 45.8,31.51 46.29,32 v46.35,32 | R1.2 28.16,13.25 v28.19,13.21 | U6.5 25.08,14.92 25.91,15.75 v25.91,17.27 | U5.2 28.32,21.97 v28.45,21.84
  Top 0.254: C14.1 35.43,23.75 37.1,25.42 U3.59 36.85,25.42 v36.83,25.4 | U3.23 45.99,25.92 v45.97,25.91 | R13.7 28.12,34.87 v27.94,35.05 | U4.2 32.89,33.91 v32.77,33.78
  Top 0.305: R14.7 R14.5 | R14.7 43.87,37.7 R18.6 R18.8 R15.2 R15.4 R15.6 R15.8 | R14.7 R23.1 R23.3 R23.5 R23.7 | R16.4 R16.2 | R16.8 R16.4 | R13.1 R13.3 R13.5 R13.7 | U3.44 40.8,30.32 v40.96,30.16 v43.5,30.16 | U3.54 39.03,27.92 v39.24,28.13 | U8.2 47.62,36.76 v47.62,36.83 | R16.4 58.31,37.23 v58.42,37.34 | D7.5 v38.23,10.16 | D8.2 43.43,10.16 43.69,9.91 v43.56,9.91 | D9.2 v48.51,10.16 | D9.5 50.8,10.16 v51.31,9.65 | D7.2 40.26,10.16 v41.08,9.34 | D8.5 45.53,10.16 46.16,9.53 v46.16,9.08 | C6.1 23.44,11.56 | 23.44,11.56 U2.3 | 23.44,11.56 25.52,11.56 v25.91,11.18
  Bottom 0.178: v42.42,32.89 42.42,32.64 42.29,32.51 | v46.35,32 46.23,32.26 | v28.19,13.21 28.19,13.46 | v25.91,17.27 26.16,17.53 | v28.45,21.84 28.45,21.34
  Bottom 0.254: v36.83,25.4 36.58,25.4 | v45.97,25.91 45.72,25.91 | v27.94,35.05 27.94,35.31 | v32.77,33.78 32.51,33.78
  Bottom 0.305: 40.58,30.16 v40.96,30.16 | v39.24,28.13 39.24,28.45 | v47.62,36.83 48.01,36.89 | v58.42,37.34 58.42,37.59 | v38.23,10.16 38.61,9.91 | v48.51,10.16 48.51,9.91 | v51.31,9.65 51.31,9.91 | v41.08,9.34 41.15,9.14 | v46.16,9.08 46.16,8.83 | v25.91,11.18 26.42,11.18
  pour Bottom (rank 3): 0,53.34 68.58,53.34 68.58,0 0,0
+5V  (via drill 0.33, 0.38)
  Top 0.178: RN1.3 21.19,36.59 21.14,36.64 | 21.14,36.64 20.95,36.83 20.95,38.23 21.34,38.61 | v23.37,38.61 21.34,38.61 | v23.37,40.89 23.37,40.64 21.34,38.61 | U7.32 13.57,33.9 v13.21,33.53 | U7.4 15.62,33.14 v15.75,33.02 v18.29,33.02 18.03,32.77 C19.1 | v20.95,34.16 20.95,36.45 21.14,36.64
  Top 0.305: R18.2 R18.4 | R18.2 R20.8 R20.6 | R20.6 R20.4 R20.2 | R5.1 R5.3 R5.5 | R5.5 R5.7 R14.1 R14.3 42.49,39.26 R18.2 | R19.2 R19.6 R19.8 57.26,39.37 v59.69,39.37 | R7.1 R7.3 R7.5 R7.7 28.85,38.61 28.19,38.61 | v60.2,29.21 59.37,28.38 T2.2 59.44,27.41 59.44,26.67 58.67,25.91 56.39,25.91 55.63,26.67 v50.8,26.67 | R5.5 43.29,42.02 v43.18,41.91 42.53,41.26 R20.6 | v35.56,13.21 v35.56,9.14 32.87,6.45 v30.48,6.45 U2.1 | v35.56,13.21 v35.56,16 | 28.19,38.61 27.18,37.59 27.18,32.26 v29.46,29.97 26.67,27.18 22.86,27.18 | v32.77,16 v35.56,13.21 | 28.19,38.61 v27.18,38.61 | U1.3 6.58,23.9 4.86,25.62 T1.4 6.67,27.24 v6.86,27.43 | 22.86,27.18 v14.22,27.18 13.46,26.42 C5.1 | v38.1,6.6 POWER.5 | R6.1 21.59,16.51 21.34,16.76 | 21.34,16.76 21.08,17.02 21.08,20.51 U5.8 21.08,20.83 22.35,20.83 22.86,21.34 22.86,27.18 | C10.2 19.65,15.07 21.34,16.76
  Bottom 0.178: v27.18,38.61 v23.37,38.61 | ICSP1.2 17.02,46.23 22.35,46.23 23.37,45.21 v23.37,40.89 | v13.21,33.53 15.24,33.53 v15.75,33.02 | v18.29,33.02 19.81,33.02 v20.95,34.16
  Bottom 0.305: v60.2,29.21 60.2,38.86 v59.69,39.37 | v43.18,41.91 43.18,33.53 43.43,33.27 43.43,31.24 42.67,30.48 42.67,26.42 | 42.67,26.42 42.67,24.89 43.18,24.38 48.51,24.38 v50.8,26.67 | v35.56,16 35.56,19.3 42.67,26.42 | v35.56,9.14 v38.1,6.6 | v32.51,11.68 34.04,11.68 v35.56,13.21 | v29.46,29.97 32.26,27.18 32.26,16.51 v32.77,16 | v6.86,27.43 13.97,27.43 v14.22,27.18 | v30.48,6.45 POWER.2
AREF  (via drill 0.33)
  Top 0.178: v34.04,20.07 34.54,20.07 34.8,20.32 34.8,21.12 C17.2 | v29.72,31.24 v29.72,33.78
  Top 0.254: C17.2 35.18,21.21 36.07,22.1 36.07,22.61 37.38,23.92 U3.62
  Bottom 0.178: JP2.8 23.88,49.28 31.24,41.91 31.24,35.31 v29.72,33.78 | v34.04,20.07 34.54,20.07 34.8,20.32 34.8,26.16 v29.72,31.24
CMP  (via drill 0.38)
  Top 0.178: R10.1 R11.2 C9.2 18.54,20.57 18.54,20.32 18.29,20.07 v18.29,19.56 | v24.13,19.56 24.13,22.86 24.64,23.37 25.91,23.37 U5.3
  Bottom 0.178: v24.13,19.56 23.11,18.54 19.3,18.54 v18.29,19.56
D+  (via drill 0.33)
  Top 0.178: USB.D+ 9.91,43.69 10.31,43.29 RN3.7 11.79,43.29 12.06,43.56 | Z1.1 11.68,46.23 12.19,45.72 12.19,43.69 12.06,43.56 | v12.19,41.85 12.19,43.43 12.06,43.56
  Bottom 0.178: USB+.TP 10.99,40.64 v12.19,41.85
D-  (via drill 0.33)
  Top 0.178: v9.91,42.42 9.98,42.49 RN3.8 11.52,41.47 Z2.1 | USB.D- 9.94,44.49 v10.16,44.7
  Bottom 0.178: USB-.TP 8.38,42.42 v9.91,42.42 10.16,42.67 v10.16,44.7
DTR  (via drill 0.33, 0.38)
  Top 0.178: U7.13 18.99,36.57 v19.18,36.39 | C11.1 v19.56,19.81 | v17.02,23.88 v17.02,25.4
  Bottom 0.178: v19.18,36.39 18.35,36.39 17.02,35.05 v17.02,25.4 | v17.02,23.88 17.02,22.35 v19.56,19.81
GATE_CMD  (via drill 0.38)
  Top 0.178: U5.7 U5.6 20.83,23.37 19.56,23.37 19.05,23.88 19.05,24.89 17.27,26.67 16.76,26.67 v16,25.91 | v2.79,25.91 2.29,26.42 2.29,27.18 T1.3
  Bottom 0.178: v2.79,25.91 v16,25.91
GND  (via drill 0.33, 0.38)
  Top 0.178: v55.05,15.56 55.37,14.73
  Top 0.254: 46.3,30.29 U3.33 46.3,27.5 45.85,27.05 | 40.3,28.79 U3.45 | 40.3,28.79 40.39,28.7 | 40.3,28.79 40.42,28.79 U3.PAD 45.47,26.67 45.85,27.05 | U3.24 46.48,26.42 45.85,27.05 | U8.1 46.97,35.07 v47.05,34.86 | v47.24,32 47.24,31.5 46.99,31.24
  Top 0.305: 43.43,21.59 43.3,21.73 U3.10 43.3,23.25 43.18,23.37 42.42,23.37 42.42,26.54 U3.PAD | v3.3,46.23 3.3,45.97 | U7.3 15.12,35.57 U7.EXP | J1.GND@3 49.86,14.55 v51.05,15.75 | v49.28,22.61 49.53,22.61 51.31,20.83 v51.31,20.57
  Bottom 0.254: v47.24,32 47.24,33.53 47.05,33.72 v47.05,34.86
  Bottom 0.305: GROUND.1 2.54,45.47 v3.3,46.23 | v51.05,15.75 53.66,15.75 53.85,15.56 v55.05,15.56 | v43.18,14.48 42.16,13.46 39.37,13.46 38.86,12.95 v38.61,12.95 | v45.97,23.37 46.48,22.86 49.02,22.86 v49.28,22.61 | v51.31,20.57 51.05,20.32 v48.51,20.32
  pour Top (rank 2): 0,53.34 68.58,53.34 68.58,0 0,0
M8RXD  (via drill 0.33)
  Top 0.178: R20.3 40.49,42.06 40.01,42.55 38.73,42.55 38.1,41.91 38.1,40.9 | 38.1,40.9 U4.15 | 38.1,40.9 38.1,40.13 38.61,39.62 v38.61,38.86 | U7.9 18.64,34.57 UART0.1
  Bottom 0.178: v38.61,38.86 38.61,34.8 36.07,32.26 23.62,32.26 23.37,32 UART0.1
M8TXD  (via drill 0.33)
  Top 0.178: R20.1 40.86,42.96 40.51,42.93 38.1,42.93 37.44,42.27 U4.16 37.44,39.78 v37.59,39.62 | U7.8 18.3,34.02 20.07,32.26 20.07,30.61 UART0.2 23.11,31.37 v23.11,32.77
  Bottom 0.178: v37.59,39.62 37.59,34.54 35.81,32.77 v23.11,32.77
MISO  (via drill 0.33)
  Top 0.178: R23.4 45.87,35.71 46.23,36.07 46.23,36.83 46.86,37.47 49.15,37.47 49.57,37.04 U8.5 49.57,34.59 48.96,33.97 | U3.39 43.3,31.86 44.2,32.77 45.09,32.77 45.72,33.4 48.39,33.4 48.96,33.97 | ICSP.1 63.59,30.48 63.5,30.48 59.69,34.29 54.61,34.29 v54.36,34.04 | 48.96,33.97 v49.21,33.72
  Bottom 0.178: v54.36,34.04 49.53,34.04 v49.21,33.72
MISO2
  Top 0.178: U7.17 17.62,39.52 15.75,41.4 ICSP1.1
MISO-PIN  (via drill 0.33)
  Top 0.178: R5.4 46.12,42.82 46.86,43.56 v47.69,43.56 48.45,43.56 49.57,42.44 U8.20 | SPI.2 JP2.5 | v49.02,48.77 49.02,44.32 v50.16,43.24
  Bottom 0.178: SPI.2 32.38,47.62 33.53,46.48 35.81,46.48 36.51,47.18 40.58,47.18 42.04,48.64 46.35,48.64 46.61,48.39 48.64,48.39 v49.02,48.77 | v50.16,43.24 48.01,43.24 v47.69,43.56
MOSI  (via drill 0.33)
  Top 0.178: R23.2 45.5,36.61 46.74,37.85 49.78,37.85 50.22,37.41 U8.6 50.22,33.2 v49.85,32.83 49.59,33.02 45.97,33.02 45.34,32.38 44.32,32.38 43.8,31.86 U3.38 | ICSP.4 66.09,27.89 64.77,29.21 63.37,29.21 58.67,33.91 55.5,33.91 v55.24,33.66
  Bottom 0.178: v55.24,33.66 54.61,33.02 50.04,33.02 v49.85,32.83
MOSI2
  Top 0.178: U7.16 18.18,43.29 17.02,44.45 17.02,46.23 ICSP1.4
MOSI-PIN  (via drill 0.33)
  Top 0.178: R5.2 45.5,43.73 46.23,44.45 47.24,44.45 | 47.24,44.45 48.07,44.45 50.22,42.3 U8.19 | v46.99,49.53 46.99,44.7 47.24,44.45
  Bottom 0.178: SPI.3 36.58,47.62 D11-J.1 36.7,48.9 37.34,49.53 v46.99,49.53
N$1
  Top 0.178: RFTX.C R9.2
N$2
  Top 0.178: RN1.4 22.68,37.4 L.A
N$3
  Top 0.305: PWR.A 24.37,16.61 R6.2
N$4
  Top 0.305: B1.4 41.65,18.57 C12.1
N$5  (via drill 0.33)
  Top 0.178: R7.4 30.84,40.28 31.75,39.37 33.78,39.37 34.19,39.78 U4.21 34.19,43.15 v32.26,45.09 | v58.42,47.5 DIGITAL0.3
  Bottom 0.178: v32.26,45.09 32.51,45.34 36.2,45.34 36.89,46.04 40.96,46.04 41.91,46.99 46.48,46.99 46.99,47.5 v58.42,47.5
N$6
  Top 0.178: U3.57 36.58,26.42 35.73,25.57 Q1.1 34.04,26.67 32.51,26.67 31.88,26.04 C1.2
N$7
  Top 0.178: U3.56 36.32,26.92 36.07,26.67 34.54,26.67 33.53,27.69 33.53,27.68 | 33.53,27.68 33.53,27.18 33.4,27.3 C2.2 | 33.53,27.68 Q1.3
N$9
  Top 0.305: B1.3 43.45,18.57 C13.1
N$11  (via drill 0.33)
  Top 0.178: U4.17 36.79,38.65 37.34,38.1 38.86,38.1 40.06,39.3 R18.1 41.33,39.3 41.66,39.62 41.66,43.94 v42.67,44.96 | v53.34,46.23 DIGITAL0.5
  Bottom 0.178: v42.67,44.96 42.93,45.21 50.61,45.21 51.12,45.72 52.96,45.72 v53.34,46.23
N$12  (via drill 0.33)
  Top 0.178: 30.92,38.68 R7.8 30.84,38.35 34.54,38.35 35.49,39.3 U4.19 35.49,43.89 v35.12,44.26 | v48.26,46.23 DIGITAL0.7
  Bottom 0.178: v35.12,44.26 35.18,44.26 35.5,44.58 36.51,44.58 37.21,45.28 41.21,45.28 41.91,45.97 48.01,45.97 v48.26,46.23
N$13  (via drill 0.33)
  Top 0.178: R18.3 40.02,38.5 39.24,37.72 37.21,37.72 36.14,38.79 U4.18 v36.13,43.69 | v50.8,46.23 DIGITAL0.6
  Bottom 0.178: v36.13,43.69 37.34,44.9 41.34,44.9 42.04,45.59 50.16,45.59 v50.8,46.23
N$14  (via drill 0.33)
  Top 0.178: R7.6 30.88,39.48 31.5,38.86 34.29,38.86 34.84,39.41 U4.20 34.84,43.52 v33.72,44.64 | v55.88,46.74 DIGITAL0.4
  Bottom 0.178: v33.72,44.64 34.04,44.96 36.32,44.96 37.02,45.66 41.08,45.66 41.91,46.48 46.48,46.48 46.99,46.99 55.63,46.99 v55.88,46.74
N$15  (via drill 0.33)
  Top 0.178: R7.2 30.8,41.08 32,39.88 33.27,39.88 33.54,40.14 U4.22 33.54,42.91 v30.73,45.72 | v45.72,47.62 DIGITAL0.8
  Bottom 0.178: v30.73,45.72 36.07,45.72 36.77,46.42 40.83,46.42 42.04,47.62 v45.72,47.62
N$16
  Top 0.178: R16.7 55.59,35.01 55.24,34.67 53.78,34.67 | 53.78,34.67 53.47,34.99 U8.11 | U3.25 48.76,26.92 53.59,31.75 53.59,34.48 53.78,34.67
N$17
  Top 0.178: R16.3 53.23,37.23 52.82,36.82 U8.10 52.82,31.61 48.63,27.42 U3.26
N$18  (via drill 0.38)
  Top 0.305: J1.C 46.98,15.86 v45.21,15.86 B1.1
  Bottom 0.305: RF-TEST.TP 45.2,15.88 v45.21,15.86
N$19
  Top 0.178: U8.3 48.27,34.55 47.94,34.23 46.8,34.23 46.12,34.91 R23.6 44.94,34.91 44.7,34.67 44.7,33.85 44.39,33.53 43.94,33.53 42.3,31.88 U3.41
N$20
  Top 0.178: RFRX.C R8.2
N$21
  Top 0.178: R13.6 30.84,35.67 31.75,36.58 33.78,36.58 34.19,36.17 U4.4 34.19,31.98 36.58,29.59 36.58,29.46 37.12,28.92 U3.52
N$22
  Top 0.178: R13.4 30.88,36.47 31.5,37.08 34.04,37.08 34.84,36.28 U4.5 34.84,31.84 37.26,29.42 U3.51
N$23
  Top 0.305: U3.8 42.3,20.92 C12.2
N$24
  Top 0.305: U3.9 42.8,20.92 C13.2
N$28  (via drill 0.38)
  Top 0.178: v25.91,19.81 25.91,20.57 U5.1 | v21.59,25.4 21.59,24.64 21.08,24.64 U5.5
  Bottom 0.178: v25.91,19.81 25.91,21.08 v21.59,25.4
N$29  (via drill 0.33)
  Top 0.178: 44.45,20.57 v44.7,20.32 44.3,20.73 U3.12 | v34.8,11.18 34.54,10.92 27.43,10.92 25.4,12.95 24.86,12.95 U6.4
  Bottom 0.178: v44.7,20.32 38.61,14.22 37.85,14.22 v34.8,11.18
N$31
  Top 0.178: RN1.2 22.34,35.8 TX.A
N$32
  Top 0.178: RN1.1 22.68,34.99 RX.A
N$33
  Top 0.178: U8.4 48.92,34.44 48.33,33.85 45.76,33.85 R23.8 45.5,33.82 44.83,33.15 44.07,33.15 42.8,31.87 U3.40
N$34
  Top 0.178: Q2.3 7.87,30.48 10.83,30.48 C3.2 13.04,30.57 14.62,32.15 U7.2
N$35
  Top 0.178: Q2.1 8.98,31.58 C7.2 13.6,32.77 14.12,33.29 U7.1
N$37
  Top 0.178: R4.1 57.01,27.94 T2.1
N$38
  Top 0.178: U4.12 39.39,34.52 39.77,34.14 R15.5 41.29,34.14 41.66,33.78 41.66,32.77 41.8,32.63 U3.42
N$39
  Top 0.178: U4.11 38.74,33.91 39.3,33.34 R15.7 40.86,32.3 41.3,31.86 U3.43
N$40
  Top 0.178: R18.7 40.71,36.9 40.64,36.83 37.34,36.83 36.79,36.28 U4.8 36.79,31.54 37.26,31.07 U3.48
N$41
  Top 0.178: 30.66,37.27 R13.2 30.84,37.59 34.54,37.59 35.49,36.65 U4.6 35.49,31.69 37.26,29.92 U3.50
N$42
  Top 0.178: R18.5 40.02,37.7 39.56,37.27 37.02,37.27 36.14,36.39 U4.7 36.14,31.55 37.27,30.42 U3.49
N$43
  Top 0.178: R13.8 30.8,34.87 32,36.07 33.27,36.07 33.54,35.8 U4.3 33.54,32.12 36.07,29.59 36.07,29.21 36.86,28.42 U3.53
N$44  (via drill 0.33)
  Top 0.178: R17.1 57.22,5.77 v57.91,5.08
  Bottom 0.178: v57.91,5.08 57.91,5.97 A5-J.1
N$45  (via drill 0.33)
  Top 0.178: R17.3 58.02,8.02 v60.96,5.08
  Bottom 0.178: v60.96,5.08 A6-J.1
N$46  (via drill 0.33)
  Top 0.178: U3.5 40.8,21.43 v40.89,21.34
  Bottom 0.178: v40.89,21.34 52.07,21.34 53.85,19.56 55.37,19.56 JP1.6
N$47  (via drill 0.33)
  Top 0.178: U3.6 41.3,23.03 v41.15,23.18 | v55.37,21.59 55.37,19.56 JP1.8
  Bottom 0.178: v41.15,23.18 41.15,22.61 41.91,21.84 53.59,21.84 53.85,21.59 v55.37,21.59
N$48  (via drill 0.33)
  Top 0.178: D7.4 37.02,9.21 36.58,9.65 v36.58,11.68 36.58,12.19 36.58,22.35 37.64,23.42 U3.63 | R12.2 52.16,10.32 v51.82,10.67
  Bottom 0.178: v51.82,10.67 51.56,10.92 45.72,10.92 45.47,10.67 40.89,10.67 40.13,11.43 36.83,11.43 v36.58,11.68
N$49  (via drill 0.33)
  Top 0.178: D7.1 v39.94,12.26 39.94,13.15 38.15,14.94 U3.64 | R12.4 53.58,11.2 v53.4,11.37
  Bottom 0.178: v53.4,11.37 45.59,11.37 45.34,11.11 41.08,11.11 v39.94,12.26
N$50  (via drill 0.33)
  Top 0.178: D8.1 42.1,9.21 41.66,9.65 v41.66,11.94 38.8,14.8 U3.1 | R12.6 54.38,11.66 v54.23,11.81
  Bottom 0.178: v54.23,11.81 53.85,12.19 47.94,12.19 47.69,11.94 45.66,11.94 45.21,11.49 42.1,11.49 v41.66,11.94
N$51  (via drill 0.33)
  Top 0.178: D8.4 v45.02,12.13 44.45,12.7 41.4,12.7 39.3,14.81 U3.2 | R12.8 55.17,12.13 v55.18,12.32
  Bottom 0.178: v55.18,12.32 54.93,12.57 47.75,12.57 47.5,12.32 45.21,12.32 45.09,12.19 45.07,12.19 v45.02,12.13
N$52  (via drill 0.33)
  Top 0.178: D9.1 47.18,9.21 46.74,9.65 46.74,12.45 v47.24,12.95 46.99,13.21 41.4,13.21 39.8,14.81 U3.3 | R17.2 57.22,11.49 v56.39,12.32
  Bottom 0.178: v47.24,12.95 55.75,12.95 v56.39,12.32
N$53
  Top 0.178: 50.09,12.25 D9.4 | 50.09,12.25 50.8,12.95 57.15,12.95 58.02,12.08 R17.4 | 50.09,12.25 50.09,12.64 49.02,13.72 41.4,13.72 40.77,14.35 40.39,14.73 40.3,14.82 U3.4
N$54
  Top 0.178: R12.1 52.77,4.51 ANALOG.1
N$55
  Top 0.178: R12.3 53.58,2.77 ANALOG.2
N$56
  Top 0.178: R12.5 54.38,4.04 ANALOG.3
N$57
  Top 0.178: ANALOG.4 58.42,2.79 55.17,6.04 R12.7
N$58
  Bottom 0.178: ANALOG.5 60.96,2.79 59.44,4.32 59.44,7.11 58.93,7.62 A5-J.2
N$59
  Bottom 0.178: ANALOG.6 63.5,6.35 62.23,7.62 A6-J.2
N$60
  Top 0.178: U8.21 48.92,42.52 48.51,42.93 46.74,42.93 45.83,42.02 R5.6 44.85,42.02 44.7,42.16 44.7,49.02 42.93,50.8 JP2.1
N$61  (via drill 0.33)
  Top 0.178: JP2.4 34.04,50.29 36.51,47.82 v37.97,47.82
  Bottom 0.178: 38.1,48.26 38.23,48.13 v37.97,47.82 38.1,47.88 38.1,48.26 | 38.1,48.26 D11-J.2
N$62  (via drill 0.33)
  Top 0.178: U3.14 45.3,21.76 v47.5,19.56
  Bottom 0.178: v47.5,19.56 51.82,19.56 53.85,17.53 55.4,17.53 JP1.10
N$63
  Top 0.178: U3.21 U3.22
  Top 0.305: U3.21 48.45,24.92 C16.1
N$64
  Top 0.254: C18.2 35.18,22.48 37.62,24.92 U3.60
N$65  (via drill 0.33)
  Top 0.178: R20.5 40.28,41.26 v39.62,41.91 39.12,41.91 38.74,41.53 U4.14 | v40.07,43.51 40.07,44.26 39.12,45.21 JP2.2
  Bottom 0.178: v40.07,43.51 40.07,42.35 v39.62,41.91
N$66  (via drill 0.33)
  Top 0.178: v49.53,26.67 50.8,27.94 R4.2 | v44.51,30.1 44.8,30.38 U3.36
  Bottom 0.178: v49.53,26.67 47.94,26.67 v44.51,30.1
N$67
  Top 0.178: R2.2 58.38,29.63 T2.3
N$68
  Top 0.178: R19.7 52.76,39.44 52.17,40.03 U8.16 52.17,42.77 52.45,43.05 52.45,43.75 53.53,44.83 62.99,44.83 63.5,45.34 DIGITAL0.1
N$69
  Top 0.178: R14.4 46.34,39.26 46.48,39.12 51.05,39.12 51.52,39.58 U8.17 51.52,42.63 52.07,43.18 52.07,43.88 53.4,45.21 59.56,45.21 60.96,46.61 DIGITAL0.2
N$70
  Top 0.178: U3.15 45.8,21.77 46.23,21.34 48.45,21.34 52.58,17.21 52.58,13.97 53.09,13.46 55.88,13.46 56.39,13.97 56.39,14.54 JP1.12
N$71
  Top 0.178: U3.19 51.01,23.92 JP1.5
N$74
  Top 0.178: U3.16 48.06,22.27 53.09,17.27 53.09,16 54.37,14.72 JP1.11
N$78  (via drill 0.33)
  Top 0.178: U4.24 U4.23 32.89,41.79 v32.77,41.91 | U8.23 U8.24 46.99,41.63 46.99,40.89 46.74,40.64 v46.74,40.39 | R2.1 56.48,31.33 v57.66,32.51
  Bottom 0.178: v57.66,32.51 57.66,37.34 56.39,38.61 48.51,38.61 v46.74,40.39 44.45,42.67 42.67,42.67 40.13,40.13 39.37,40.13 37.59,41.91 v32.77,41.91
PD4  (via drill 0.33)
  Top 0.178: U3.29 47.91,28.92 v48.13,29.15
  Bottom 0.178: v48.13,29.15 49.53,29.15 52.45,26.23 52.45,24.48 JP1.3
PD7  (via drill 0.33)
  Top 0.178: U3.32 46.95,30.56 v48.32,31.94
  Bottom 0.178: v48.32,31.94 48.58,31.94 53.02,27.5 55.05,27.5 56.37,26.18 JP1.2
PWM-10  (via drill 0.33)
  Top 0.178: R20.7 40.14,40.46 v39.76,40.84 U4.13 | JP2.3 37.59,50.8 38.61,49.78 v38.61,43.51
  Bottom 0.178: v38.61,43.51 38.61,41.99 v39.76,40.84
PWM-11  (via drill 0.33)
  Top 0.178: R5.8 46.3,41.22 46.48,41.4 46.48,42.16 46.86,42.55 47.88,42.55 48.27,42.15 U8.22 v48.26,40.64 | v50.04,49.53 50.04,45.72 51.05,44.7 v51.05,43.56
  Bottom 0.178: D11-J.3 40.39,48.26 41.15,49.02 46.48,49.02 46.74,48.77 47.24,48.77 48.01,49.53 v50.04,49.53 | v51.05,43.56 51.05,41.15 50.55,40.64 v48.26,40.64
PWRIN
  Top 0.305: X1.1A X1.1B 10.99,15.75 D1.A
RD+  (via drill 0.33)
  Top 0.178: RN3.2 14.08,43.29 v14.48,43.69 | v9.91,37.08 9.91,36.83 10.67,36.07 U7.29
  Bottom 0.178: v14.48,43.69 14.99,43.69 16,42.67 16,40.89 14.99,39.88 12.19,39.88 9.91,37.59 v9.91,37.08
RD-  (via drill 0.33)
  Top 0.178: RN3.1 14.29,42.49 v14.48,42.67 | v9.14,36.32 9.91,35.56 U7.30
  Bottom 0.178: v14.48,42.67 14.99,42.67 15.49,42.16 15.49,40.89 14.99,40.39 11.43,40.39 9.14,38.1 v9.14,36.32
RESET  (via drill 0.33, 0.38)
  Top 0.178: v60.96,24.89 63.18,24.89 ICSP.5 | S1.1 23.62,2.54 25.4,4.32 | 25.4,4.32 31.24,4.32 POWER.3 | 25.4,4.32 v26.86,5.78 | U6.2 v25.4,13.97 25.95,13.97 R1.1 v26.92,16 | v18.29,16.51 18.54,16.76 19.56,16.76 C11.2
  Bottom 0.178: v60.96,24.89 61.72,24.13 61.72,16.76 56.39,11.43 56.39,6.35 54.36,4.32 34.29,4.32 33.02,3.05 POWER.3 | v26.86,5.78 26.86,12.51 v25.4,13.97 | v18.29,16.51 26.42,16.51 v26.92,16
RESET2  (via drill 0.33)
  Top 0.178: U7.24 14.12,39.02 14.48,39.37 16,39.37 v16.26,39.62 | RN1.6 20.05,36.59 19.56,37.08 19.56,39.62 v20.07,40.13
  Bottom 0.178: v16.26,39.62 16.26,40.39 ICSP1.5 20.07,44.2 v20.07,40.13
RFRX  (via drill 0.33)
  Top 0.178: RFRX.A 58.61,20.32 JP1.4 | U3.31 47.38,29.92 v48.32,30.86
  Bottom 0.178: v48.32,30.86 49.09,30.86 52.83,27.11 54.8,27.11 55.44,26.48 55.44,23.62 56.37,22.69 JP1.4
RFTX  (via drill 0.33)
  Top 0.178: JP1.1 54.44,24.56 55.37,23.62 56.64,23.62 58.29,21.97 RFTX.A | U3.30 47.39,29.42 48.07,30.1 v48.7,30.1
  Bottom 0.178: v48.7,30.1 49.34,30.1 54.36,25.08 54.36,24.57 JP1.1
RXD0
  Top 0.178: R15.3 40.49,34.94 39.37,36.07 38.35,36.07 38.09,35.8 U4.10 38.09,33.28 39.8,31.58 U3.46
RXD1
  Top 0.178: R16.1 52.76,38.03 52.17,37.44 U8.9 52.17,31.6 48.49,27.92 U3.27
RXLED
  Top 0.178: U7.10 19.54,35.07 19.61,34.99 RN1.8
SCK  (via drill 0.33)
  Top 0.178: R14.8 46.04,37.66 46.61,38.23 50.42,38.23 50.87,37.77 U8.7 50.87,32.71 v50.16,32 49.72,32 49.09,32.64 46.1,32.64 45.47,32 44.58,32 44.3,31.72 U3.37 | ICSP.3 63.64,28.43 58.55,33.53 56.52,33.53 v56.26,33.27
  Bottom 0.178: v56.26,33.27 55.44,32.45 50.61,32.45 v50.16,32
SCK2
  Top 0.178: ICSP1.3 19.05,44.2 19.05,37.85 18.8,37.59 18.2,37.59 U7.15
SCK-PIN  (via drill 0.33)
  Top 0.178: R14.2 46.04,40.06 46.61,39.5 50.42,39.5 50.87,39.95 U8.18 50.87,42.49 51.69,43.31 51.69,45.66 52.07,46.04 v52.07,48.26 | JP2.6 SPI.1 20.28,38.95 RN1.5
  Bottom 0.178: SPI.1 30.04,47.62 31.56,46.1 35.94,46.1 36.64,46.8 40.7,46.8 42.16,48.26 46.23,48.26 46.48,48.01 51.82,48.01 v52.07,48.26
SCL  (via drill 0.33, 0.38)
  Top 0.178: R19.1 55.59,42.52 v55.4,42.7 55.18,42.93 54.1,42.93 53.47,42.3 U8.14 | JP2.10 18.8,50.29 20.07,49.02 25.15,49.02 v25.4,48.77
  Bottom 0.178: A6-J.3 61.98,9.14 62.87,10.03 62.87,12.83 62.48,13.21 62.48,40.64 60.2,42.93 55.63,42.93 v55.4,42.7 53.59,40.89 52.32,40.89 51.82,41.4 51.82,43.94 51.37,44.39 43.94,44.39 43.37,43.81 42.29,43.81 41.97,44.13 38.16,44.13 36.64,42.61 35.5,42.61 35.12,42.99 30.8,42.99 25.4,48.39 v25.4,48.77
SDA  (via drill 0.33, 0.38)
  Top 0.178: R19.5 v53.98,40.24 53.23,40.24 52.82,40.65 U8.15 52.82,42.53 v53.02,42.74 | JP2.9 22.61,49.53 25.91,49.53 v26.67,48.77
  Bottom 0.178: v53.98,40.24 53.99,40.26 60.33,40.26 62.1,38.48 62.1,14.61 57.78,10.29 A5-J.3 | v26.67,48.77 26.67,47.75 30.99,43.43 35.31,43.43 35.69,43.05 36.39,43.05 37.85,44.51 42.1,44.51 42.42,44.2 43.18,44.2 43.75,44.77 52.51,44.77 53.02,44.26 v53.02,42.74
TOSC1
  Top 0.178: U3.18 49.51,23.42 JP1.7 54.98,18.56 55.94,17.59 58.5,17.59 Q3.1 61.15,18.52 C8.2
TOSC2
  Top 0.178: U3.17 48.01,22.92 JP1.9 55.01,16.56 56.01,15.56 58.97,15.56 Q3.2 61.4,16.02 C21.2
TXD0
  Top 0.178: U3.47 39.3,31.57 38.86,32 37.85,32 37.44,32.41 U4.9 37.44,36.17 37.72,36.45 39.5,36.45 40.2,35.74 R15.1
TXD1
  Top 0.178: R14.6 46.34,38.46 46.48,38.61 51.05,38.61 51.52,38.14 U8.8 51.52,31.58 48.36,28.42 U3.28
TXLED
  Top 0.178: U7.11 19.65,35.57 19.88,35.8 RN1.7
UGND  (via drill 0.33)
  Top 0.305: v4.32,43.94 6.17,42.09 USB.GND 8.71,42.09 9.65,41.15 9.65,39.88 | 9.65,39.88 9.65,38.61 9.78,38.48 | U7.28 11.69,36.57 9.78,38.48 | L1.1 9.91,39.62 9.65,39.88 | C20.2 8.64,37.34 9.78,38.48
  Bottom 0.305: v4.32,43.94 3.56,43.18 GROUND.2
USBVCC
  Top 0.305: U7.31 12.21,35.07 11.18,34.04 3.81,34.04 3.17,33.4 F2.1 2.26,30.79 T1.1 | T1.1 T1.2 T1.5 | T1.1 T1.6
USHIELD  (via drill 0.33)
  Top 0.305: USB.GND@3 USB.GND@1 2.08,49.32 3.05,50.29 10.16,50.29 13.19,47.26 Z1.2 v13.21,47.24 | L1.2 13.97,39.62 14.48,40.13 v14.48,41.4 13.51,41.4 Z2.2
  Bottom 0.305: v13.21,47.24 13.21,42.67 v14.48,41.4
VIN  (via drill 0.38)
  Top 0.178: C4.1 12.83,20.28 R10.2
  Top 0.305: U1.1 11.92,19.28 C4.1 12.83,19.47 D1.C 17.78,15.75 v18.29,15.24 | POWER.8 45.72,3.3 v43.69,5.33
  Bottom 0.305: v43.69,5.33 37.08,5.33 27.43,14.99 25.4,14.99 25.15,15.24 v18.29,15.24
VUCAP  (via drill 0.33)
  Top 0.305: C20.1 8.38,35.56 v8.89,35.05 | U7.27 12.46,37.07 v11.94,37.59
  Bottom 0.305: v8.89,35.05 9.4,35.05 v11.94,37.59
XUSB  (via drill 0.33)
  Top 0.305: v3.3,36.83 3.3,35.73 F2.2 | v9.4,45.47 7.63,45.47 USB.VBUS
  Bottom 0.305: v3.3,36.83 3.3,41.66 7.37,45.72 USB-5V.TP 9.14,45.72 v9.4,45.47

### Text on the board
tNames: 10 | 9 | 8 | 7 | 6 | 5 | 4 | 3 | 2 | 1 | 0 | DIGITAL | TX | RX | AREF | GND | 13 | 12 | 11 | TX | RX | 1 | ZigDuino | www.logos-electro.com/zigduino | ANALOG IN | RESET | 3V3 | 5V Gnd Vin | 0 1 2 3 4 5 | CC BY-SA 3.0 | www.logos-electro.com/zigduino
bNames: MOSI | PWM | Product of Logos Electromechanical | www.logos-electro.com | I2C | ANALOG
Reference: C8 | R7 | R5 | R6 | R4 | C3 | C2 | R9 | R8 | R1 | R2 | C1 | C4 | C5 | X2 | C7 | C6